# Altium schematic sheet Mixer10_7M.SchDoc
size A4
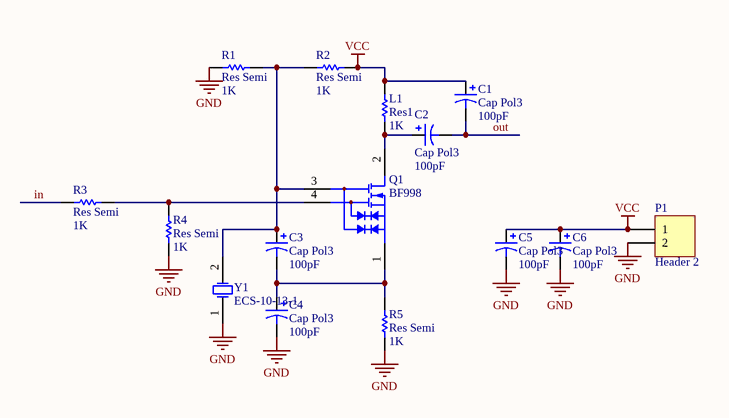
[diagram p0: Mixer10_7M.SchDoc]

## Parts
C1  Cap Pol3  value 100pF  [C0805]
C2  Cap Pol3  value 100pF  [C0805]
C3  Cap Pol3  value 100pF  [C0805]
C4  Cap Pol3  value 100pF  [C0805]
C5  Cap Pol3  value 100pF  [C0805]
C6  Cap Pol3  value 100pF  [C0805]
L1  Res1  value 1K  [AXIAL-0.3]
P1  Header 2  [HDR1X2]
Q1  BF998  [SOT143_N]
R1  Res Semi  value 1K  [2012[0805]]
R2  Res Semi  value 1K  [2012[0805]]
R3  Res Semi  value 1K  [2012[0805]]
R4  Res Semi  value 1K  [2012[0805]]
R5  Res Semi  value 1K  [2012[0805]]
Y1  ECS-10-13-1  [HC-49U]

## Nets
GND: C4.2 C5.2 C6.2 P1.2 R1.1 R4.1 R5.1 Y1.1(OSC1)
VCC: C1.1 C5.1 C6.1 L1.2 P1.1 R2.2
in: R3.2
out: C1.2 C2.2
NetC2_1: C2.1 L1.1 Q1.2(D)
NetC3_1: C3.1 Q1.3(G2) R1.2 R2.1 Y1.2(OSC2)
NetC3_2: C3.2 C4.1 Q1.1(S) R5.2
NetQ1_4: Q1.4(G1) R3.1 R4.2

## Library data of the parts
C1-C6 = Cap Pol3: Polarized Capacitor (Surface Mount); Published: 8-Jun-2000; LatestRevisionDate: 17-Jul-2002; LatestRevisionNote: Re-released for DXP Platform.; PackageReference: C0805; Publisher: Altium Limited
L1 = Res1: Resistor; Published: 8-Jun-2000; LatestRevisionDate: 17-Jul-2002; LatestRevisionNote: Re-released for DXP Platform.; PackageReference: AXIAL-0.3; Publisher: Altium Limited
P1 = Header 2: Header, 2-Pin; LatestRevisionDate: 17-Jul-2002; LatestRevisionNote: Re-released for DXP Platform.; Publisher: Altium Limited
Q1 = BF998: Silicon N-channel Dual-gate MOSFET; Published: 17-Sep-2003; LatestRevisionDate: 12-Dec-2006; LatestRevisionNote: IPC-7351 Footprint Added.; DatasheetVersion: Aug-1996; PackageVersion: Sep-1996; PackageReference: SOT143; Publisher: Altium Limited; PackageDescription: 4-Pin SOT-143 Package 1.9 mm Pitch, 2.3 mm Lead Span; Code_IPC: SOT143; ComponentLink1Description: Manufacturer Link; ComponentLink1URL: http://www.semiconductors.philips.com/; ComponentLink2Description: Datasheet; ComponentLink2URL: http://www.semiconductors.philips.com/acrobat/datasheets/BF998_2.pdf
R1-R5 = Res Semi: Semiconductor Resistor; Published: 8-Jun-2000; LatestRevisionDate: 17-Jul-2002; LatestRevisionNote: Re-released for DXP Platform.; PackageReference: AXIAL-0.5; Publisher: Altium Limited
Y1 = ECS-10-13-1: Crystal Oscillator; Published: 17-Jul-2002; DatasheetDocument: 18-Apr-2000; PackageReference: HC-49U; Publisher: Altium Limited; ComponentLink1Description: Manufacturer Link; ComponentLink1URL: http://www.ecsxtal.com/; ComponentLink2Description: Datasheet; ComponentLink2URL: http://www.ecsxtal.com/pdf2/HC49U.PDF